# EAGLE design atxpi (EAGLE 6.5.0)
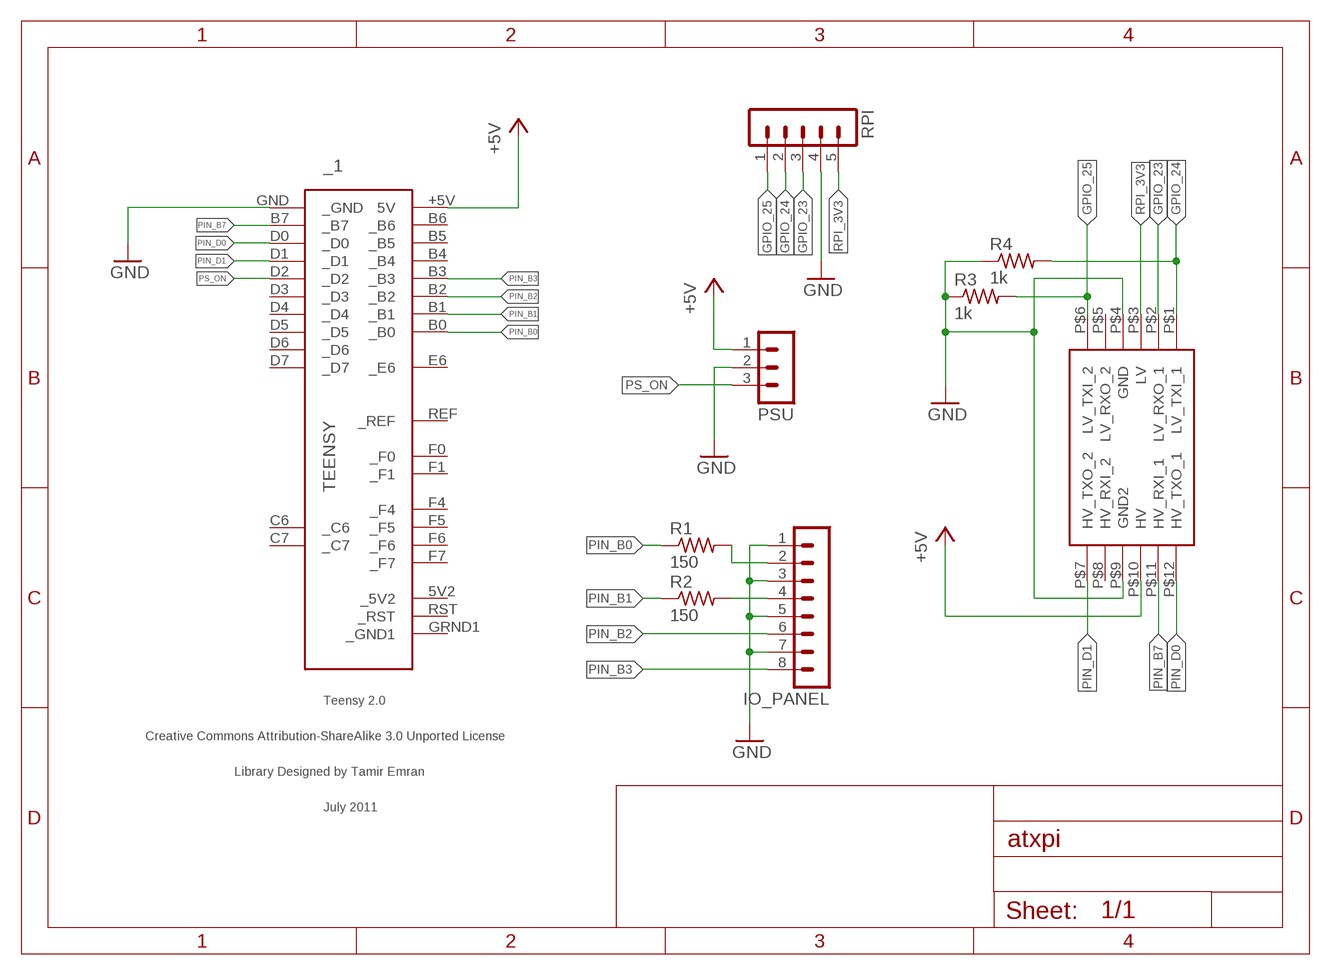
[diagram p0: schematic, sheet 1]

## Parts
_1  TEENSY  [TEENSY]
IO_PANEL  MA08-1  [MA08-1]
PSU  MA03-1  [MA03-1]
R1  150  R-US_0309/12  [0309/12]
R2  150  R-US_0309/12  [0309/12]
R3  1k  R-US_0309/12  [0309/12]
R4  1k  R-US_0309/12  [0309/12]
RPI  MA05-1  [MA05-1]
U$1  LOGIC_LEVEL_CONVERTER  [LOGIC_LEVEL_CONVERTER]

## Nets
+5V: _1.+5V(5V) PSU.1 U$1.P$10(HV)
GND: _1.GND(_GND) IO_PANEL.1 IO_PANEL.3 IO_PANEL.5 IO_PANEL.7 PSU.2 R3.1 R4.1 RPI.4 U$1.P$4(GND) U$1.P$9(GND2)
GPIO_23: RPI.3 U$1.P$2(LV_RXO_1)
GPIO_24: R4.2 RPI.2 U$1.P$1(LV_TXI_1)
GPIO_25: R3.2 RPI.1 U$1.P$6(LV_TXI_2)
HDD_LED: IO_PANEL.4 R2.2
N$1: IO_PANEL.2 R1.2
PIN_B0: _1.B0(_B0) R1.1
PIN_B1: _1.B1(_B1) R2.1
PIN_B2: _1.B2(_B2) IO_PANEL.6
PIN_B3: _1.B3(_B3) IO_PANEL.8
PIN_B7: _1.B7(_B7) U$1.P$11(HV_RXI_1)
PIN_D0: _1.D0(_D0) U$1.P$12(HV_TXO_1)
PIN_D1: _1.D1(_D1) U$1.P$7(HV_TXO_2)
PS_ON: _1.D2(_D2) PSU.3
RPI_3V3: RPI.5 U$1.P$3(LV)
Unconnected: _1.5V2(_5V2) _1.B4(_B4) _1.B5(_B5) _1.B6(_B6) _1.C6(_C6) _1.C7(_C7) _1.D3(_D3) _1.D4(_D4) _1.D5(_D5) _1.D6(_D6) _1.D7(_D7) _1.E6(_E6) _1.F0(_F0) _1.F1(_F1) _1.F4(_F4) _1.F5(_F5) _1.F6(_F6) _1.F7(_F7) _1.GRND1(_GND1) _1.REF(_REF) _1.RST(_RST) U$1.P$5(LV_RXO_2) U$1.P$8(HV_RXI_2)

## Library data of the parts
_1 = teensy:TEENSY: Teensy 2.0 Original Design by Clint Fisher Modified Design by Tamir Emran Licensed Under Creative Commons Attribution-ShareAlike 3.0 Unported (CC BY-SA 3.0)
IO_PANEL = con-lstb:MA08-1: PIN HEADER; OC_FARNELL: unknown; OC_NEWARK: unknown
PSU = con-lstb:MA03-1: PIN HEADER; OC_FARNELL: unknown; OC_NEWARK: unknown
R1 R2 = rcl:R-US_: RESISTOR, American symbol
R3 R4 = resistor:R-US_: RESISTOR, American symbol
RPI = con-lstb:MA05-1: PIN HEADER; OC_FARNELL: unknown; OC_NEWARK: unknown
U$1 = SparkFun-Boards:LOGIC_LEVEL_CONVERTER: Logic Level Converter (3.3v - 5v) https://www.sparkfun.com/products/8745

## Board
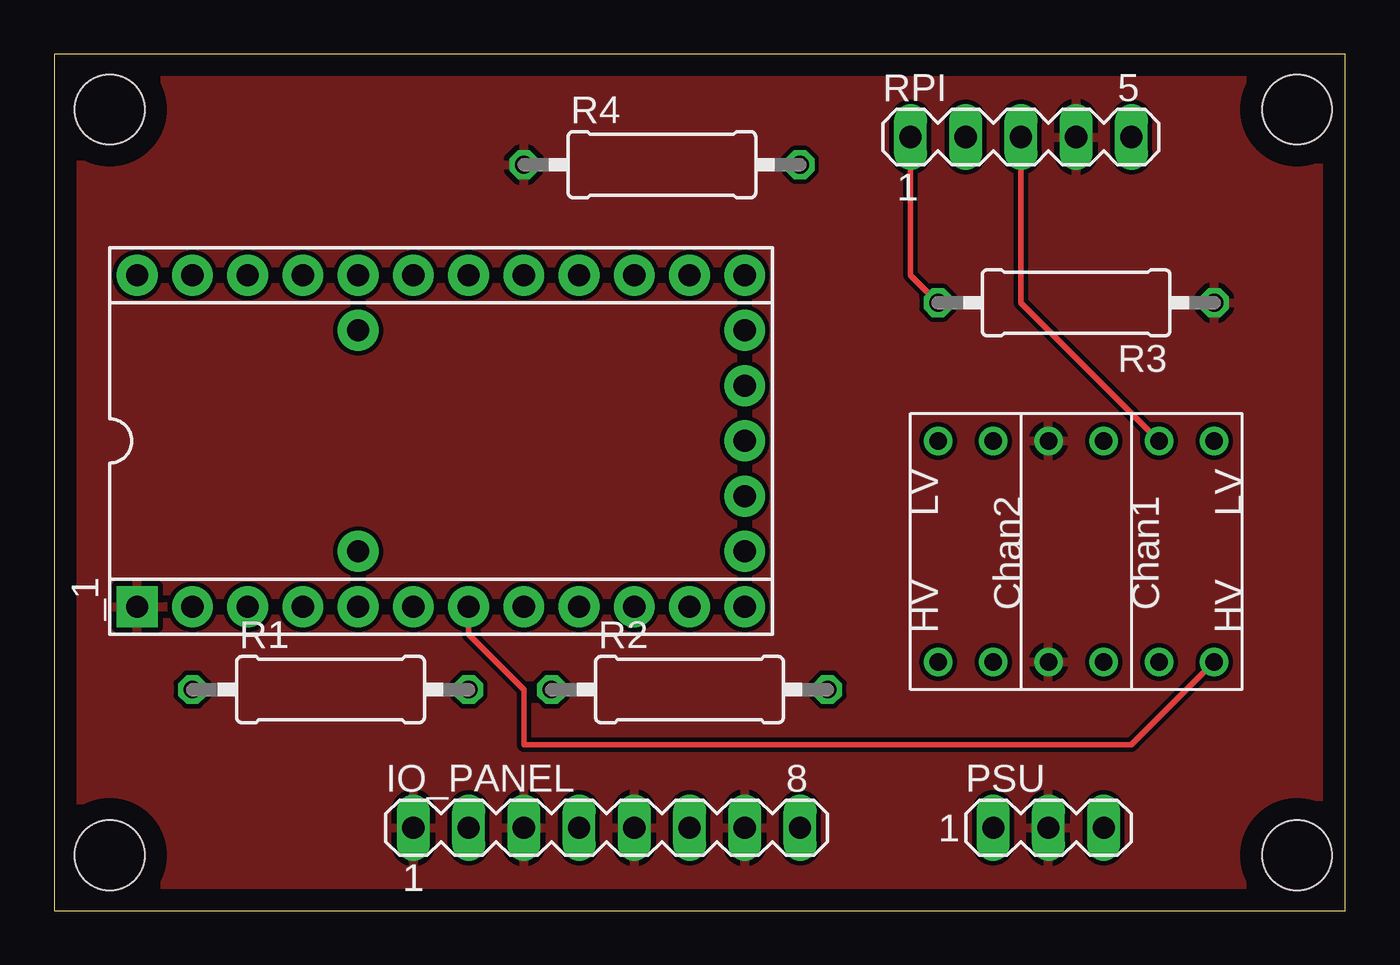
[diagram p1: board, top side]
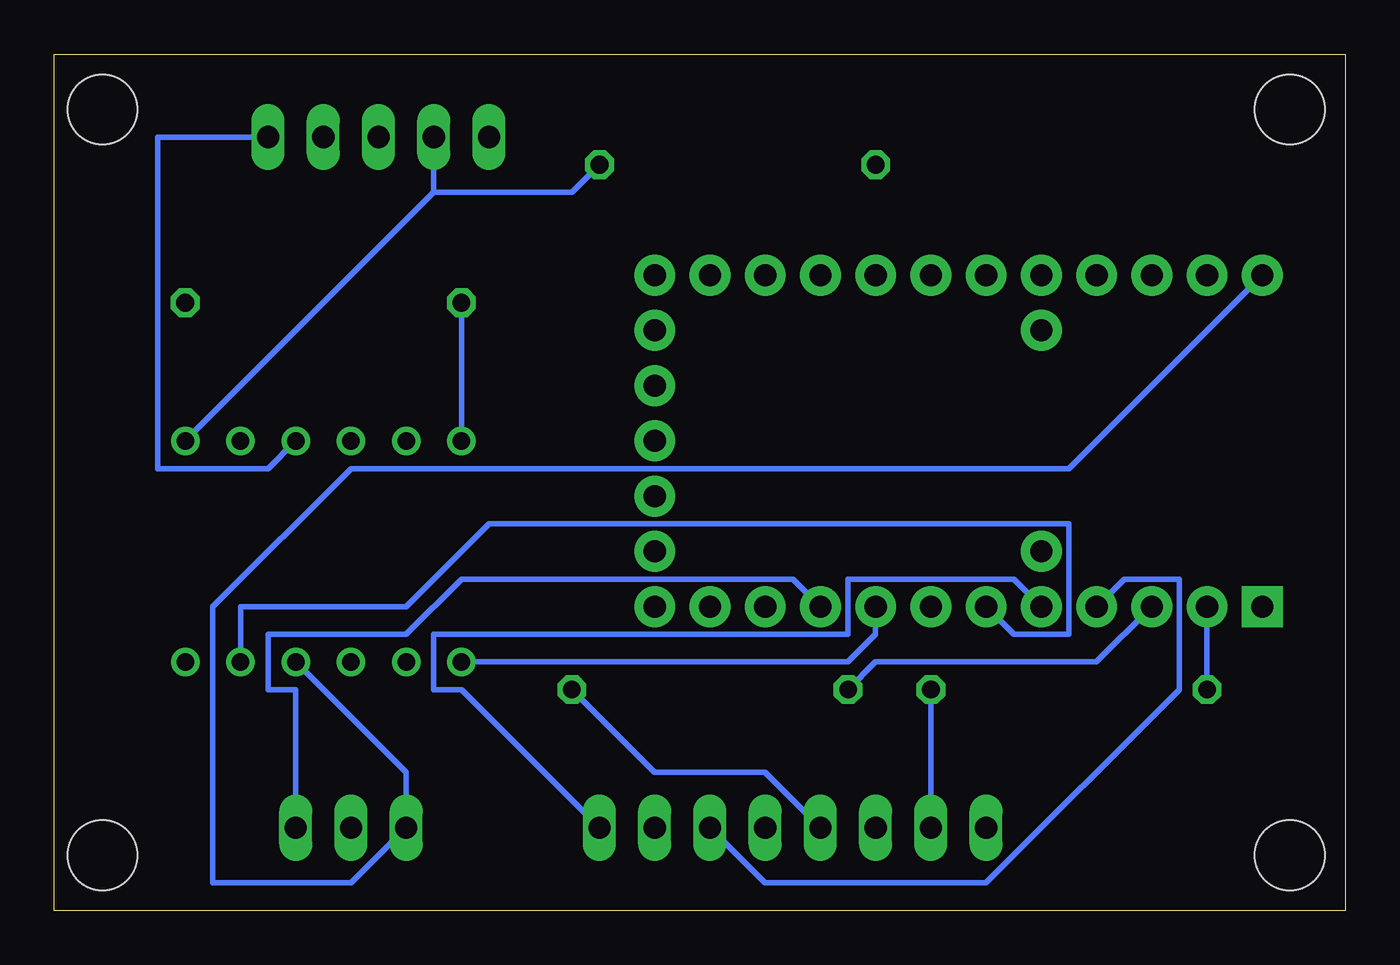
[diagram p2: board, bottom side, seen from below]

Size 59.36 x 39.36 mm. Coordinates in mm from the lower left corner, seen from the top.
Outline: 0,0 59.36,0 59.36,39.36 0,39.36 0,0
Copper layers (1*16): Top 0.035mm / dielectric 1.5mm / Bottom 0.035mm
Design rules "default": minimum track width 10mil, minimum drill 24mil, track to track 8mil, track to pad 8mil, pad to pad 8mil, via to via 8mil, smd to smd 8mil, copper to edge 40mil, drill to drill 8mil, minimum pad ring 10mil, minimum via ring 8mil, stop-mask expansion 4mil, vias tented up to drill 0mil, thermal gap 10mil
Holes 3.2 mm at 2.54,2.54 2.54,36.83 57.15,36.83 57.15,2.54

### Footprints (pad centres in the part's own frame; a part is rotated, then mirrored left to right if it is on the bottom)
TEENSY = drill 1.016 pad 1.88: 5V2 13.97,-2.54; +5V -13.97,7.62; B0 -11.43,-7.62; B1 -8.89,-7.62; B2 -6.35,-7.62; B3 -3.81,-7.62; B4 8.89,7.62; B5 6.35,7.62; B6 3.81,7.62; B7 -1.27,-7.62; C6 11.43,-7.62; C7 13.97,-7.62; D0 1.27,-7.62; D1 3.81,-7.62; D2 6.35,-7.62; D3 8.89,-7.62; D4 13.97,5.08; D5 13.97,-5.08; D6 13.97,7.62; D7 11.43,7.62; E6 -3.81,-5.08; F0 -11.43,7.62; F1 -8.89,7.62; F4 -6.35,7.62; F5 -3.81,7.62; F6 -1.27,7.62; F7 1.27,7.62; GRND1 13.97,0; REF -3.81,5.08; RST 13.97,2.54 | drill 1.016 pad 1.88 square: GND -13.97,-7.62
MA08-1 = drill 1.016 long: 1 -8.89,0; 2 -6.35,0; 3 -3.81,0; 4 -1.27,0; 5 1.27,0; 6 3.81,0; 7 6.35,0; 8 8.89,0
MA03-1 = drill 1.016 long: 1 -2.54,0; 2 0,0; 3 2.54,0
0309/12 = drill 0.813 octagon: 1 -6.35,0; 2 6.35,0
MA05-1 = drill 1.016 long: 1 -5.08,0; 2 -2.54,0; 3 0,0; 4 2.54,0; 5 5.08,0
LOGIC_LEVEL_CONVERTER = drill 0.8: P$1 1.27,13.97; P$2 1.27,11.43; P$3 1.27,8.89; P$4 1.27,6.35; P$5 1.27,3.81; P$6 1.27,1.27; P$7 11.43,1.27; P$8 11.43,3.81; P$9 11.43,6.35; P$10 11.43,8.89; P$11 11.43,11.43; P$12 11.43,13.97

### Placement (x,y rotation side)
_1  17.78,21.59 0 top
IO_PANEL  25.4,3.81 0 top
PSU  45.72,3.81 0 top
R1  12.7,10.16 0 top
R2  29.21,10.16 0 top
R3  46.99,27.94 180 top
R4  27.94,34.29 0 top
RPI  44.45,35.56 0 top
U$1  39.37,22.86 270 top

### Tracks (layer width: path | path; a pad name or v marks a point on that pad's centre or on a via)
+5V
  Bottom 0.254: U$1.P$10 43.18,6.35 PSU.1 45.72,1.27 52.07,1.27 52.07,13.97 45.72,20.32 12.7,20.32 _1.+5V
GND
  pour Top: 0,39.37 59.69,39.37 59.69,36.83 59.69,0 0,0
GPIO_23
  Top 0.254: U$1.P$2 44.45,27.94 RPI.3
GPIO_24
  Bottom 0.254: 41.91,33.02 U$1.P$1 | RPI.2 41.91,33.02 | R4.2 35.56,33.02 41.91,33.02
GPIO_25
  Top 0.254: RPI.1 39.37,29.21 R3.2
  Bottom 0.254: R3.2 U$1.P$6
HDD_LED
  Bottom 0.254: R2.2 31.75,6.35 26.67,6.35 IO_PANEL.4
N$1
  Bottom 0.254: IO_PANEL.2 R1.2
PIN_B0
  Bottom 0.254: _1.B0 R1.1
PIN_B1
  Bottom 0.254: R2.1 21.59,11.43 11.43,11.43 _1.B1
PIN_B2
  Bottom 0.254: IO_PANEL.6 26.67,1.27 16.51,1.27 7.62,10.16 7.62,15.24 10.16,15.24 _1.B2
PIN_B3
  Bottom 0.254: IO_PANEL.8 40.64,10.16 41.91,10.16 41.91,12.7 22.86,12.7 22.86,15.24 15.24,15.24 _1.B3
PIN_B7
  Bottom 0.254: U$1.P$11 50.8,13.97 43.18,13.97 39.37,17.78 12.7,17.78 12.7,12.7 15.24,12.7 _1.B7
PIN_D0
  Top 0.254: U$1.P$12 49.53,7.62 21.59,7.62 21.59,10.16 19.05,12.7 _1.D0
PIN_D1
  Bottom 0.254: U$1.P$7 22.86,11.43 21.59,12.7 _1.D1
PS_ON
  Bottom 0.254: PSU.3 48.26,10.16 49.53,10.16 49.53,12.7 43.18,12.7 40.64,15.24 25.4,15.24 _1.D2
RPI_3V3
  Bottom 0.254: U$1.P$3 49.53,20.32 54.61,20.32 54.61,35.56 RPI.5